# Altium project VCU.PrjPcb (part 2 of 4)

## Sheet 12V_Buck.SchDoc: Title
size A3; Project: Q24 VCU; ENG_APP_DATE: --/--/--; DSN_APP_DATE: --/--/--; CHK_APP_DATE: --/--/--; Date: *******; ApprovedBy: *******; CheckedBy: None; Author: *******; CompanyName: *******; DrawnBy: Jacob Chisholm; Engineer: *******; Organization: *******; Address1: *******; Address2: *******; Address3: *******; Address4: *******; DocumentNumber: 10; Revision: *******; SheetNumber: 10; SheetTotal: 14; Address_Website: https://jchisholm204.github.io; E-Mail: JacobChisholm1010@gmail.com; CurrentTime: *******; CurrentDate: *******; Time: *******; DocumentFullPathAndName: *******; DocumentName: *******; ModifiedDate: *******; ImagePath: *******; ProjectName: *******; Application_BuildNumber: *******
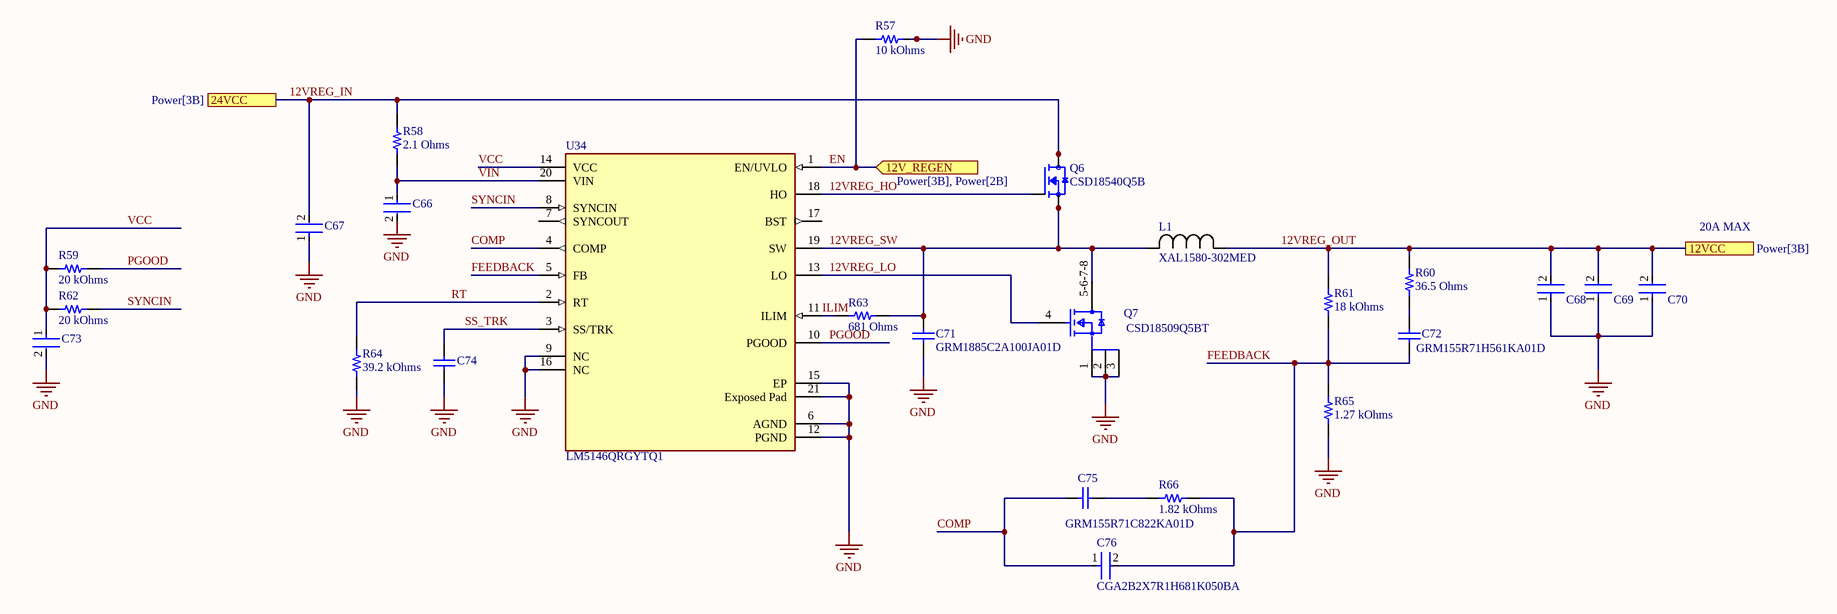
[diagram p5: 12V_Buck.SchDoc]

### Parts
C66  CGA3E2X7R1H104K080AA  [FP-CGA3E-0_3-0_1-IPC_A]  (value not drawn)
C67  GRM32ER71H475KA88L  [FP-GRM32-MFG]  (value not drawn)
C68  GRM32ER61E226KE15L  [FP-GRM32-MFG]  (value not drawn)
C69  GRM32ER61E226KE15L  [FP-GRM32-MFG]  (value not drawn)
C70  GRM32ER61E226KE15L  [FP-GRM32-MFG]  (value not drawn)
C71  GRM1885C2A100JA01D  [CAPC1608X90X35LL10T15]
C72  GRM155R71H561KA01D  [CAPC1005X55X25LL05T10]
C73  C1005X5R1V225K050BC  [FP-C1005-050-0_15-IPC_A]  (value not drawn)
C74  GRM155R71C563KA88D  [CAPC1005X55X25ML05T10]  (value not drawn)
C75  GRM155R71C822KA01D  [CAPC1005X55X25NL05T10]
C76  CGA2B2X7R1H681K050BA  [FP-CGA2B-IPC_C]
L1  XAL1580-302MED  [IND_XAL1580-302MED_COC]
Q6  CSD18540Q5B  [TRANS_CSD18540Q5B]
Q7  CSD18509Q5BT  [FP-DNK0008A-MFG]
R57  10 kOhms  [RES 0603_1608]
R58  2.1 Ohms  [RES 0603_1608]
R59  20 kOhms  [RES 0603_1608]
R60  36.5 Ohms  [RES 0603_1608]
R61  18 kOhms  [RES 0603_1608]
R62  20 kOhms  [RES 0603_1608]
R63  681 Ohms  [RES 0402_1005]
R64  39.2 kOhms  [RES 0603_1608]
R65  1.27 kOhms  [RES 0603_1608]
R66  1.82 kOhms  [RES 0603_1608]
U34  LM5146QRGYTQ1  [FP-RGY0020B-MFG]

### Ports
12V_REGEN (in, see Power[3B], Power[2B]), 12VCC (see Power[3B]), 24VCC (see Power[3B])

### Nets
GND: C66.2 C67.1 C68.1 C69.1 C70.1 C71.1 C73.2 C74.1 Q7.1(S) Q7.2(S) Q7.3(S) R57.2 R64.1 R65.1 U34.6(AGND) U34.9(NC) U34.12(PGND) U34.15(EP) U34.16(NC) U34.21(Exposed_Pad)
12VREG_HO: Q6.4(G) U34.18(HO)
12VREG_IN: C67.2 Q6.5(D) Q6.6(D) Q6.7(D) Q6.8(D) R58.2 ; port 24VCC
12VREG_LO: Q7.4(G) U34.13(LO)
12VREG_OUT: C68.2 C69.2 C70.2 L1.1 R60.2 R61.2 ; port 12VCC
12VREG_SW: C71.2 L1.2 Q6.1(S) Q6.2(S) Q6.3(S) Q7.5-6-7-8(D) R63.2 U34.19(SW)
COMP: C75.1 C76.1 U34.4(COMP)
EN: R57.1 U34.1(EN/UVLO) ; port 12V_REGEN  [project net 12V_REG_EN]
FEEDBACK: C72.1 C76.2 R61.1 R65.2 R66.2 U34.5(FB)
ILIM: R63.1 U34.11(ILIM)
PGOOD: R59.2 U34.10(PGOOD)
RT: R64.2 U34.2(RT)
SS_TRK: C74.2 U34.3(SS/TRK)
SYNCIN: R62.2 U34.8(SYNCIN)
VCC: C73.1 R59.1 R62.1 U34.14(VCC)
VIN: C66.1 R58.1 U34.20(VIN)
NetC72_2: C72.2 R60.1
NetC75_2: C75.2 R66.1

Not connected (* = marked no-connect by the designer): U34 7(SYNCOUT) 17(BST)

### Notes on the sheet
- 20A MAX
- Title:
- Drawn By:
- Page Contents:
- Checked By:
- Size:
- Date:
- File:
- License:
- Email:
- A3
- Number:
- Time:
- Revision:
- Sheet
- Website:
- of

### Library data of the parts
C66 = CMP-2000-07546-2: Cap Ceramic 100nF 50V X7R 10% Pad SMD 0603 +125°C Automotive T/R; Weight: 7.1E-05oz; Composition: Ceramic; Max Operating Temperature: 125°C; Termination: SMD/SMT; Dielectric: X7R; Length: 1.6mm; Package Quantity: 1; REACH SVHC: No SVHC; Lead Free: Lead Free; Case Code (Metric): 1608; Min Operating Temperature: -55°C; Packaging: Tape and Reel; Tolerance: 10%; Voltage Rating: 50V; Case Code (Imperial): 0603; Capacitance: 100nF; Case/Package: 0603; Voltage Rating (DC): 50V; Depth: 0.8mm; Radiation Hardening: No; Ratings: AEC-Q200; Mount: Surface Mount; Voltage: 50V; Thickness: 0.035inch; Width: 0.8mm; Height: 0.8mm
C67 = CMP-1038-02162-3: CAP CER 4.7UF 50V X7R 1210; Manufacturer: Murata; Tolerance: 10%; Temperature Coefficient: 15%; Material: Ceramic; Lead Free: Yes; Value: 4.7uF; ComponentLink2Description: Datasheet; Capacitance: 4.7uF; Digikey Description: CAP CER 4.7UF 50V X7R 1210; Category: Cap; Automotive: No; ComponentLink2URL: https://search.murata.co.jp/Ceramy/image/img/A01X/G101/ENG/GRM32ER71H475KA88-01A.pdf; Package: GRM32; Device Class L2: Capacitors; Voltage Rating: 50V; Device Class L1: Passive Components; Mouser Description: Capacitor Capacitance tolerance: ±10% Ceramic type: X7R Construction form: 1210 Capacitance: 4.7 µF Rated voltage: 50...; Octopart: https://octopart.com/grm32er71h475ka88l-murata-196576; Temperature: -55°C to +125°C; Temperature Range Low: -55°C; Height: 2.7mm; Manufacturer Part Number: GRM32ER71H475KA88L; Temperature Characteristic: X7R; Temperature Range High: +125°C; RoHS: TRUE; Device Class L3: Ceramic Capacitors
C68-C70 = CMP-2000-05458-2: CAP CER 22UF 25V X5R 1210; Manufacturer: Murata Electronics North America; Possible Substitute: GRM32ER61E226KE15K; Other Names: 490-3889-2; Material: Ceramic; Tolerance: 10%; Digikey Description: CAP CER 22UF 25V X5R 1210; Mouser Description: Multilayer Ceramic Capacitors MLCC - SMD/SMT 1210 22uF 25volts X5R 10%; Device Class L2: Capacitors; Height: 2.7mm; Temperature Characteristic: X5R; Category: Cap; RoHS: TRUE; Operating Temperature: -55°C ~ 85°C; Temperature: -55°C to +85°C; Lead Free: Yes; Package: GRM32; Temperature Range High: +85°C; Package / Case: 1210 (3225 Metric); Standard Package: 1,000; Packaging: Cut Tape (CT); Capacitance: 22uF; Thickness (Max): 0.106" (2.70mm); Value: 22uF; Automotive: No; Device Class L1: Passive Components; Voltage - Rated: 25V; Temperature Range Low: -55°C; Size / Dimension: 0.126" L x 0.098" W (3.20mm x 2.50mm); ComponentLink2Description: Datasheet; Device Class L3: Ceramic Capacitors; Temperature Coefficient: X5R; ComponentLink2URL: https://search.murata.co.jp/Ceramy/image/img/A01X/G101/ENG/GRM32ER61E226KE15-01A.pdf; Voltage Rating: 25V; Manufacturer Part Number: GRM32ER61E226KE15L; Octopart: https://octopart.com/grm32er61e226ke15l-murata-197441; Applications: General Purpose; Mounting Type: Surface Mount, MLCC
C71 = CMP-1035-00565-2: Manufacturer: Murata; Part Number: GRM1885C2A100JA01D
C72 = CMP-2008-04664-1: Manufacturer: Murata; Part Number: GRM155R71H561KA01D
C73 = CMP-08246-007153-1: CAP CER 2.2UF 35V X5R 0402; Dielectric Material: Ceramic; Tolerance: 10%; Package Quantity: 1; Voltage Rating: 35V; Case Code (Metric): 1005; Width: 0.5mm; RoHS Compliant: Yes; Capacitance: 2.2uF; Min Operating Temperature: -55°C; Packaging: Tape and Reel; Voltage Rating (DC): 35V; Thickness: 0.022inch; REACH SVHC: No SVHC; Max Operating Temperature: 85°C; Length: 1mm; Case Code (Imperial): 0402; Resistor Type: Ceramic; Lead Free: Lead Free; Series: C; Termination: SMD/SMT; Height: 0.5mm; Mount: Surface Mount; Case/Package: 0402; Weight: 2.3E-05oz; Dielectric: X5R; Depth: 0.5mm
C74 = CMP-2008-04611-1: Manufacturer: Murata; Part Number: GRM155R71C563KA88D
C75 = CMP-2008-03950-1: Manufacturer: Murata; Part Number: GRM155R71C822KA01D
C76 = CMP-08246-001669-1: Cap Ceramic 680pF 50V X7R 10% Pad SMD 0402 +125°C Automotive T/R; Thickness: 0.022inch; Case Code (Metric): 1005; Voltage Rating: 50V; REACH SVHC: No SVHC; Packaging: Tape and Reel; Min Operating Temperature: -55°C; Case/Package: 0402; Weight: 2.3E-05oz; Tolerance: 10%; Dielectric: X7R; Width: 0.02inch; Case Code (Imperial): 0402; Depth: 0.5mm; Mount: Surface Mount; Length: 1mm; Max Operating Temperature: 125°C; Composition: Ceramic; Termination: SMD/SMT; Voltage Rating (DC): 50V; Height: 0.5mm; Capacitance: 680pF; Ratings: AEC-Q200; Package Quantity: 1
L1 = XAL1580-302MED: No Description Available; Mfr_Name: Coilcraft; Type: DEV; Copyright: Copyright (C) 2024 Ultra Librarian. All rights reserved.; Manufacturer_Part_Number: XAL1580-302MED; RefDes: RefDes
Q6 = CSD18540Q5B: 60-V, N channel NexFETâ„¢ power MOSFET, single SON 5 mm x 6 mm, 2.2 mOhm; MF: Texas Instruments; SnapEDA_Link: https://www.snapeda.com/parts/CSD18540Q5B/Texas+Instruments/view-part/?ref=snap; Purchase-URL: https://pricing.snapeda.com/search/part/CSD18540Q5B/?ref=eda; Package: VSON-CLIP-8 Texas Instruments; MP: CSD18540Q5B; Price: None; Availability: In Stock; Check_prices: https://www.snapeda.com/parts/CSD18540Q5B/Texas+Instruments/view-part/?ref=eda; Value: *
Q7 = CMP-04962-000031-1: MOSFET N-CH 40V 100A 8VSON; Max Power Dissipation: 195W; Drain to Source Resistance: 1.3mR; Gate to Source Voltage (Vgs): 20V; Threshold Voltage: 1.8V; Number of Channels: 1; Rise Time: 19ns; Turn-Off Delay Time: 57ns; Element Configuration: Single; Power Dissipation: 3.1W; Rds On Max: 1.2mR; Fall Time: 11ns; Turn-On Delay Time: 9ns; Input Capacitance: 13.9nF; Packaging: Tape and Reel; Weight: 0.000847oz; Lead Free: Contains Lead; Contact Plating: Gold; Drain to Source Breakdown Voltage: 40V; Max Operating Temperature: 150°C; Number of Elements: 1; Package Quantity: 250; Mount: Surface Mount; Drain to Source Voltage (Vdss): 40V; Number of Pins: 8; Min Operating Temperature: -55°C; REACH SVHC: No SVHC; RoHS Compliant: Yes; Continuous Drain Current (ID): 100A
R57 = AA0603FR-0710KL: RES SMD 10K OHM 1% 1/10W 0603; Manufacturer: Yageo; Power (Watts): 0.1W, 1/10W; Temperature Coefficient: ±150ppm/°C; Part Number: AA0603FR-0710KL; Value: 10 kOhms; ComponentLink1Description: Datasheet; ComponentLink1URL: https://www.yageo.com/upload/media/product/productsearch/datasheet/rchip/PYu-AA_51_RoHS_L_3.pdf; ComponentLink2Description: DigiKey Link; ComponentLink2URL: https://www.digikey.com/en/products/detail/yageo/AA0603FR-0710KL/5888698; Composition: Thick Film; Device Package: 0603 (1608 Metric); Features: Anti-Sulfur, Automotive AEC-Q200, Moisture Resistant; Height - Seated (Max): 0.022" (0.55mm); LastUpdated: 1/24/2024 8:37:51 PM; Lifecycle Status: Active; Minimum Order: 1; Number of Terminations: 2; Operating Temperature: -55°C ~ 155°C; Package / Case: 0603 (1608 Metric); Packaging: TapeAndReel; PartId: 64302; Part Status: Active; Price: 0.01; Ratings: AEC-Q200; Resistance: 10 kOhms; Series: AA; Size / Dimension: 0.063" L x 0.031" W (1.60mm x 0.80mm); Supplier 1: DigiKey; Supplier Part Number 1: 13-AA0603FR-0710KLCT-ND; Supplier Device Package: 0603; Tolerance: ±1%
R58 = CRCW06032R10FKEA: RES SMD 2.1 OHM 1% 1/10W 0603; Manufacturer: Vishay Dale; Power (Watts): 0.1W, 1/10W; Temperature Coefficient: ±100ppm/°C; Part Number: CRCW06032R10FKEA; Value: 2.1 Ohms; ComponentLink1Description: Datasheet; ComponentLink1URL: http://www.vishay.com/docs/20035/dcrcwe3.pdf; ComponentLink2Description: DigiKey Link; ComponentLink2URL: https://www.digikey.com/en/products/detail/vishay-dale/CRCW06032R10FKEA/1961571; Composition: Thick Film; Device Package: 0603 (1608 Metric); Features: Automotive AEC-Q200; Height - Seated (Max): 0.020" (0.50mm); LastUpdated: 1/16/2024 8:42:05 PM; Lifecycle Status: Active; Minimum Order: 1; Number of Terminations: 2; Operating Temperature: -55°C ~ 155°C; Package / Case: 0603 (1608 Metric); Packaging: TapeAndReel; PartId: 12898; Part Status: Active; Price: 0.01; Ratings: AEC-Q200; Resistance: 2.1 Ohms; Series: CRCW; Size / Dimension: 0.061" L x 0.033" W (1.55mm x 0.85mm); Supplier 1: DigiKey; Supplier Part Number 1: 541-2.10HHCT-ND; Supplier Device Package: 0603; Tolerance: ±1%
R59 R62 = AC0603FR-0720KL: RES SMD 20K OHM 1% 1/10W 0603; Manufacturer: Yageo; Power (Watts): 0.1W, 1/10W; Temperature Coefficient: ±100ppm/°C; Part Number: AC0603FR-0720KL; Value: 20 kOhms; ComponentLink1Description: Datasheet; ComponentLink1URL: https://www.yageo.com/upload/media/product/productsearch/datasheet/rchip/PYu-AC_51_RoHS_L_7.pdf; ComponentLink2Description: DigiKey Link; ComponentLink2URL: https://www.digikey.com/en/products/detail/yageo/AC0603FR-0720KL/5895907; Composition: Thick Film; Device Package: 0603 (1608 Metric); Features: Automotive AEC-Q200, Moisture Resistant; Height - Seated (Max): 0.022" (0.55mm); LastUpdated: 1/16/2024 8:41:47 PM; Lifecycle Status: Active; Minimum Order: 1; Number of Terminations: 2; Operating Temperature: -55°C ~ 155°C; Package / Case: 0603 (1608 Metric); Packaging: CutTape; PartId: 17364; Part Status: Active; Price: 0.01; Ratings: AEC-Q200; Resistance: 20 kOhms; Series: AC; Size / Dimension: 0.063" L x 0.031" W (1.60mm x 0.80mm); Supplier 1: DigiKey; Supplier Part Number 1: YAG3577CT-ND; Supplier Device Package: 0603; Tolerance: ±1%
R60 = CRCW060336R5FKEA: RES SMD 36.5 OHM 1% 1/10W 0603; Manufacturer: Vishay Dale; Power (Watts): 0.1W, 1/10W; Temperature Coefficient: ±100ppm/°C; Part Number: CRCW060336R5FKEA; Value: 36.5 Ohms; ComponentLink1Description: Datasheet; ComponentLink1URL: http://www.vishay.com/docs/20035/dcrcwe3.pdf; ComponentLink2Description: DigiKey Link; ComponentLink2URL: https://www.digikey.com/en/products/detail/vishay-dale/CRCW060336R5FKEA/1174503; Composition: Thick Film; Device Package: 0603 (1608 Metric); Features: Automotive AEC-Q200; Height - Seated (Max): 0.020" (0.50mm); LastUpdated: 1/24/2024 8:39:33 PM; Lifecycle Status: Active; Minimum Order: 1; Number of Terminations: 2; Operating Temperature: -55°C ~ 155°C; Package / Case: 0603 (1608 Metric); Packaging: TapeAndReel; PartId: 7915; Part Status: Active; Price: 0.01; Ratings: AEC-Q200; Resistance: 36.5 Ohms; Series: CRCW; Size / Dimension: 0.061" L x 0.033" W (1.55mm x 0.85mm); Supplier 1: DigiKey; Supplier Part Number 1: 541-36.5HCT-ND; Supplier Device Package: 0603; Tolerance: ±1%
R61 = AC0603FR-0718KL: RES SMD 18K OHM 1% 1/10W 0603; Manufacturer: Yageo; Power (Watts): 0.1W, 1/10W; Temperature Coefficient: ±100ppm/°C; Part Number: AC0603FR-0718KL; Value: 18 kOhms; ComponentLink1Description: Datasheet; ComponentLink1URL: https://www.yageo.com/upload/media/product/productsearch/datasheet/rchip/PYu-AC_51_RoHS_L_7.pdf; ComponentLink2Description: DigiKey Link; ComponentLink2URL: https://www.digikey.com/en/products/detail/yageo/AC0603FR-0718KL/5895836; Composition: Thick Film; Device Package: 0603 (1608 Metric); Features: Automotive AEC-Q200, Moisture Resistant; Height - Seated (Max): 0.022" (0.55mm); LastUpdated: 1/24/2024 8:38:56 PM; Lifecycle Status: Active; Minimum Order: 1; Number of Terminations: 2; Operating Temperature: -55°C ~ 155°C; Package / Case: 0603 (1608 Metric); Packaging: CutTape; PartId: 17436; Part Status: Active; Price: 0.01; Ratings: AEC-Q200; Resistance: 18 kOhms; Series: AC; Size / Dimension: 0.063" L x 0.031" W (1.60mm x 0.80mm); Supplier 1: DigiKey; Supplier Part Number 1: YAG3570CT-ND; Supplier Device Package: 0603; Tolerance: ±1%
R63 = ERJ-2RKF6810X: RES SMD 681 OHM 1% 1/10W 0402; Manufacturer: Panasonic Electronic Components; Power (Watts): 0.1W, 1/10W; Temperature Coefficient: ±100ppm/°C; Part Number: ERJ-2RKF6810X; Value: 681 Ohms; ComponentLink1Description: Datasheet; ComponentLink1URL: https://industrial.panasonic.com/cdbs/www-data/pdf/RDA0000/AOA0000C304.pdf; ComponentLink2Description: DigiKey Link; ComponentLink2URL: https://www.digikey.com/en/products/detail/panasonic-electronic-components/ERJ-2RKF6810X/192449; Composition: Thick Film; Device Package: 0402 (1005 Metric); Features: Automotive AEC-Q200; Height - Seated (Max): 0.016" (0.40mm); LastUpdated: 1/24/2024 8:27:52 PM; Lifecycle Status: Active; Minimum Order: 1; Number of Terminations: 2; Operating Temperature: -55°C ~ 155°C; Package / Case: 0402 (1005 Metric); Packaging: CutTape; PartId: 3811; Part Status: Active; Price: 0.01; Ratings: AEC-Q200; Resistance: 681 Ohms; Series: ERJ-2RK; Size / Dimension: 0.039" L x 0.020" W (1.00mm x 0.50mm); Supplier 1: DigiKey; Supplier Part Number 1: P681LCT-ND; Supplier Device Package: 0402; Tolerance: ±1%
R64 = 5-2176089-3: RES SMD 39.2K OHM 0.1% 1/6W 0603; Manufacturer: TE Connectivity Passive Product; Power (Watts): 0.167W, 1/6W; Temperature Coefficient: ±25ppm/°C; Part Number: 5-2176089-3; Value: 39.2 kOhms; ComponentLink1Description: Datasheet; ComponentLink1URL: https://www.te.com/commerce/DocumentDelivery/DDEController?Action=srchrtrv&DocNm=1773272&DocType=DS&DocLang=English; ComponentLink2Description: DigiKey Link; ComponentLink2URL: https://www.digikey.com/en/products/detail/te-connectivity-passive-product/5-2176089-3/4033729; Composition: Thin Film; Device Package: 0603 (1608 Metric); Height - Seated (Max): 0.022" (0.55mm); LastUpdated: 1/16/2024 8:41:51 PM; Lifecycle Status: Active; Minimum Order: 1; Number of Terminations: 2; Operating Temperature: -55°C ~ 155°C; Package / Case: 0603 (1608 Metric); Packaging: TapeAndReel; PartId: 16250; Part Status: Active; Price: 0.14; Resistance: 39.2 kOhms; Series: RP73P, Holsworthy; Size / Dimension: 0.061" L x 0.031" W (1.55mm x 0.80mm); Supplier 1: DigiKey; Supplier Part Number 1: A110261CT-ND; Supplier Device Package: 0603; Tolerance: ±0.1%
R65 = 2-2176088-2: RES SMD 1.27K OHM 0.1% 1/6W 0603; Manufacturer: TE Connectivity Passive Product; Power (Watts): 0.167W, 1/6W; Temperature Coefficient: ±25ppm/°C; Part Number: 2-2176088-2; Value: 1.27 kOhms; ComponentLink1Description: Datasheet; ComponentLink1URL: https://www.te.com/commerce/DocumentDelivery/DDEController?Action=srchrtrv&DocNm=1773272&DocType=DS&DocLang=English; ComponentLink2Description: DigiKey Link; ComponentLink2URL: https://www.digikey.com/en/products/detail/te-connectivity-passive-product/2-2176088-2/4033586; Composition: Thin Film; Device Package: 0603 (1608 Metric); Height - Seated (Max): 0.022" (0.55mm); LastUpdated: 1/24/2024 8:38:18 PM; Lifecycle Status: Active; Minimum Order: 1; Number of Terminations: 2; Operating Temperature: -55°C ~ 155°C; Package / Case: 0603 (1608 Metric); Packaging: TapeAndReel; PartId: 24589; Part Status: Active; Price: 0.14; Resistance: 1.27 kOhms; Series: RP73P, Holsworthy; Size / Dimension: 0.061" L x 0.031" W (1.55mm x 0.80mm); Supplier 1: DigiKey; Supplier Part Number 1: A110118CT-ND; Supplier Device Package: 0603; Tolerance: ±0.1%
R66 = AC0603FR-071K82L: RES SMD 1.82K OHM 1% 1/10W 0603; Manufacturer: Yageo; Power (Watts): 0.1W, 1/10W; Temperature Coefficient: ±100ppm/°C; Part Number: AC0603FR-071K82L; Value: 1.82 kOhms; ComponentLink1Description: Datasheet; ComponentLink1URL: https://www.yageo.com/upload/media/product/productsearch/datasheet/rchip/PYu-AC_51_RoHS_L_9.pdf; ComponentLink2Description: DigiKey Link; ComponentLink2URL: https://www.digikey.com/en/products/detail/yageo/AC0603FR-071K82L/5895873; Composition: Thick Film; Device Package: 0603 (1608 Metric); Features: Automotive AEC-Q200, Moisture Resistant; Height - Seated (Max): 0.022" (0.55mm); LastUpdated: 1/24/2024 8:37:18 PM; Lifecycle Status: Active; Minimum Order: 1; Number of Terminations: 2; Operating Temperature: -55°C ~ 155°C; Package / Case: 0603 (1608 Metric); Packaging: CutTape; PartId: 72129; Part Status: Active; Price: 0.01; Ratings: AEC-Q200; Resistance: 1.82 kOhms; Series: AC; Size / Dimension: 0.063" L x 0.031" W (1.60mm x 0.80mm); Supplier 1: DigiKey; Supplier Part Number 1: 13-AC0603FR-071K82LCT-ND; Supplier Device Package: 0603; Tolerance: ±1%
U34 = CMP-04918-000302-1: IC REG BUCK ADJ 3.5A 20VQFN; RoHS Compliant: Yes

## Sheet 5V_Buck.SchDoc: Title
size A3; Project: Q24 VCU; ENG_APP_DATE: --/--/--; DSN_APP_DATE: --/--/--; CHK_APP_DATE: --/--/--; Date: *******; ApprovedBy: *******; CheckedBy: None; Author: *******; CompanyName: *******; DrawnBy: Jacob Chisholm; Engineer: *******; Organization: *******; Address1: *******; Address2: *******; Address3: *******; Address4: *******; DocumentNumber: 11; Revision: *******; SheetNumber: 11; SheetTotal: 14; Address_Website: https://jchisholm204.github.io; E-Mail: JacobChisholm1010@gmail.com; CurrentTime: *******; CurrentDate: *******; Time: *******; DocumentFullPathAndName: *******; DocumentName: *******; ModifiedDate: *******; ImagePath: *******; ProjectName: *******; Application_BuildNumber: *******
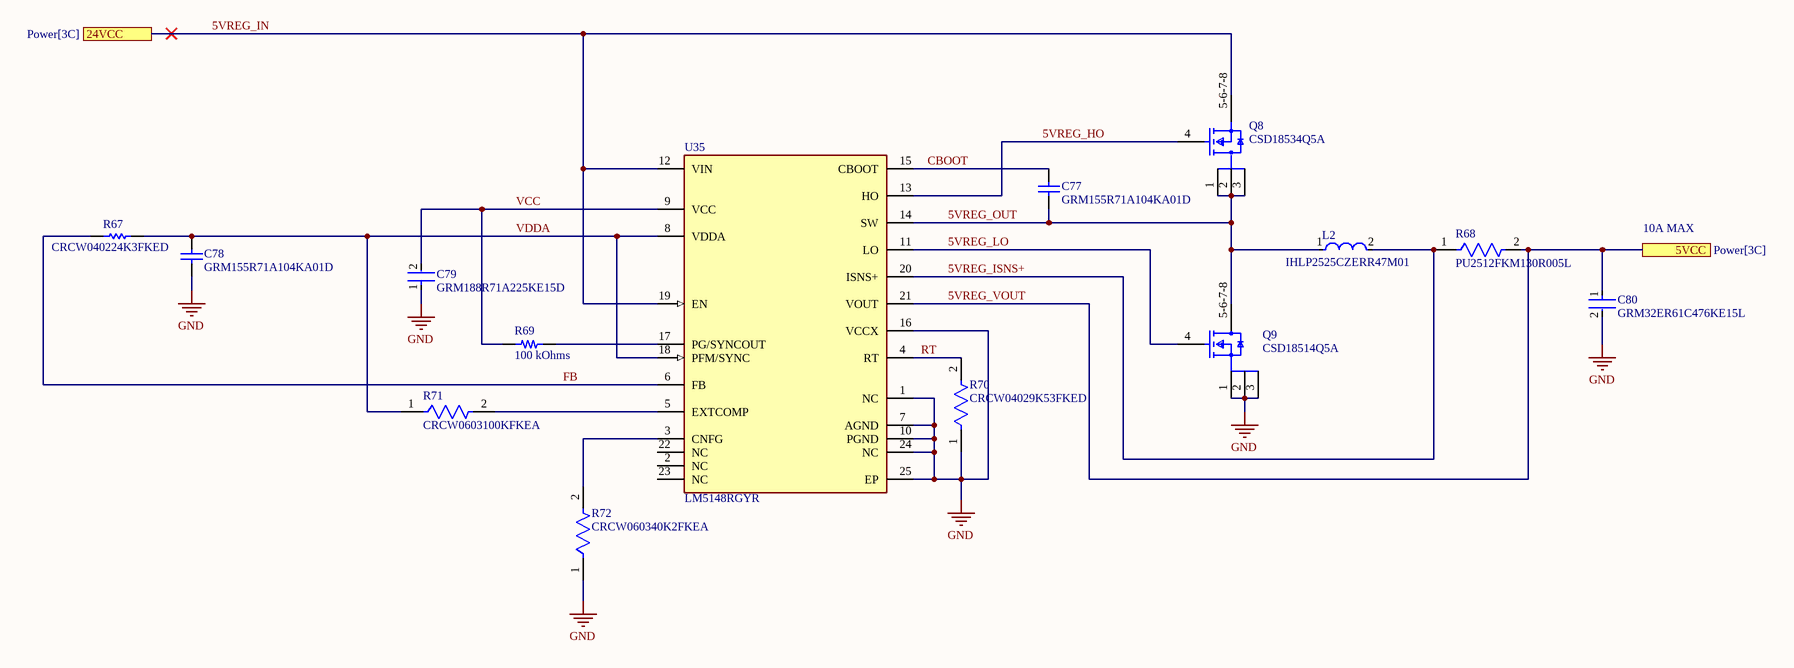
[diagram p6: 5V_Buck.SchDoc]

### Parts
C77  GRM155R71A104KA01D  [CAPC1005X55X25LL05T10]
C78  GRM155R71A104KA01D  [CAPC1005X55X25LL05T10]
C79  GRM188R71A225KE15D  [FP-GRM188-0_1-e0_2_0_5-MFG]
C80  GRM32ER61C476KE15L  [FP-GRM32E-0_3-0_2-IPC_C]
L2  IHLP2525CZERR47M01  [FP-IHLP-2525CZ-FP_2_413x3-MFG]
Q8  CSD18534Q5A  [FP-DQJ0008A-MFG]
Q9  CSD18514Q5A  [FP-DQJ0008A-MFG]
R67  CRCW040224K3FKED  [RESC1005X40X25LL05T05]
R68  PU2512FKM130R005L  [FP-PU2512-0R005-MFG]
R69  100 kOhms  [RES 0603_1608]
R70  CRCW04029K53FKED  [FP-CRCW0402-e3-MFG]
R71  CRCW0603100KFKEA  [FP-CRCW0603-e3-IPC_C]
R72  CRCW060340K2FKEA  [FP-CRCW0603-e3-IPC_B]
U35  LM5148RGYR  [FP-RGY0024F-MFG]

### Ports
5VCC (see Power[3C]), 24VCC (see Power[3C])

### Nets
GND: C78.1 C79.1 C80.2 Q9.1(S) Q9.2(S) Q9.3(S) R70.1 R72.1 U35.1(NC) U35.7(AGND) U35.10(PGND) U35.16(VCCX) U35.24(NC) U35.25(EP)
5VREG_HO: Q8.4(G) U35.13(HO)
5VREG_IN: Q8.5-6-7-8(D) U35.12(VIN) U35.19(EN) ; port 24VCC
5VREG_ISNS+: L2.2 R68.1 U35.20(ISNS+)
5VREG_LO: Q9.4(G) U35.11(LO)
5VREG_OUT: C77.1 L2.1 Q8.1(S) Q8.2(S) Q8.3(S) Q9.5-6-7-8(D) U35.14(SW)
5VREG_VOUT: C80.1 R68.2 U35.21(VOUT) ; port 5VCC
CBOOT: C77.2 U35.15(CBOOT)
FB: R67.1 U35.6(FB)
RT: R70.2 U35.4(RT)
VCC: C79.2 R69.1 U35.9(VCC)
VDDA: C78.2 R67.2 R71.1 U35.8(VDDA) U35.18(PFM/SYNC)
NetR69_2: R69.2 U35.17(PG/SYNCOUT)
NetR71_2: R71.2 U35.5(EXTCOMP)
NetR72_2: R72.2 U35.3(CNFG)

Not connected (* = marked no-connect by the designer): U35 2(NC) 22(NC) 23(NC)

### Notes on the sheet
- 10A MAX
- Title:
- Drawn By:
- Page Contents:
- Checked By:
- Size:
- Date:
- File:
- License:
- Email:
- A3
- Number:
- Time:
- Revision:
- Sheet
- Website:
- of

### Library data of the parts
C77 C78 = CMP-2000-06331-1: Chip Capacitor, 0.1 uF, +/- 10%, 10 V, -55 to 125 degC, 0402 (1005 Metric), RoHS, Tape and Reel; Manufacturer: Murata; Rated Voltage: 10V; Capacitance: 100000pF; Dielectric: X7R; Manufacturer URL: http://www.murata.com/; Datasheet Version: 02/2016; Datasheet URL: http://search.murata.co.jp/Ceramy/image/img/A01X/G101/ENG/GRM155R71A104KA01-01.pdf; Package Reference: 0402; Tolerance (%): ±10%; Package Description: 2-Pin Surface Mount Device, Body 1 x 0.5 mm; Mounting Technology: SurfaceMount; Case Size/Dimension: 0402
C79 = CMP-2006-02836-2: Chip Multilayer Ceramic Capacitors for General Purpose, 0603, 2.2uF, X7R, 15%, 10%, 10V; Case Code (Metric): 1608; Height: 0.8mm; Packaging: Cut Tape; Voltage: 10V; Lead Free: Lead Free; Min Operating Temperature: -55°C; Voltage Rating (DC): 10V; Max Operating Temperature: 125°C; Voltage Rating: 10V; Dielectric: X7R; Depth: 0.8mm; Case Code (Imperial): 0603; Termination: SMD/SMT; Case/Package: 0603; Number of Pins: 2; REACH SVHC: No SVHC; Mount: Surface Mount; Width: 0.031inch; Material: Ceramic; Capacitance: 2.2uF; Package Quantity: 1; Weight: 7.1E-05oz; Length: 1.6mm; Thickness: 0.035inch; Tolerance: 10%
C80 = CMP-2000-06362-2: CAP CER 47UF 16V X5R 1210; Tolerance: 10%; Material: Ceramic; Case Code (Metric): 3225; RoHS Compliant: Yes; Min Operating Temperature: -55°C; Radiation Hardening: No; Voltage: 16V; Package Quantity: 1; Case Code (Imperial): 1210; REACH SVHC: No SVHC; Capacitance: 47uF; Voltage Rating (DC): 16V; Dielectric: X5R; Case/Package: 1210; Length: 3.2mm; Voltage Rating: 16V; Packaging: Cut Tape; Width: 0.098inch; Number of Pins: 2; Lead Free: Lead Free; Height: 2.5mm; Mount: Surface Mount; Termination: SMD/SMT; Max Operating Temperature: 85°C; Thickness: 0.106inch; Depth: 2.5mm
L2 = CMP-2000-06445-2: Commercial Inductors, High Saturation Series 0.47uH 17.5A 4.2mΩ 20%; Saturation Current: 26A; Shielding: Shielded; Test Frequency: 100kHz; DC Resistance (DCR): 4.2mR; Self Resonant Frequency: 5MHz; Core Material: Metal; Inductance: 470nH; Case Code (Imperial): 2525; Packaging: Tape and Reel; Length: 7.24mm; Mount: Surface Mount; Contact Plating: Tin; Inductance Tolerance: 20%; Width: 6.47mm; Tolerance: 20%; Current Rating: 17.5A; Max Operating Temperature: 125°C; Min Operating Temperature: -55°C; Height - Seated (Max): 0.118inch; Case/Package: 2525; Number of Pins: 2; Depth: 6.72mm; Radiation Hardening: No; Max DC Current: 26A; Termination: SMD/SMT; Package Quantity: 2000; Lead Free: Lead Free; RMS Current (Irms): 17.5A; Height: 3mm; Military Standard: Not
Q8 = CMP-04962-000014-1: MOSFET N-CH 60V 8SON; Manufacturer: Texas Instruments; Reverse Recovery Time: 40ns; Input Capacitace At Vds: 1360pF @ 30V; Transconductance: 72S; Gate Charge At Vgs: 17nC @ 10V; Threshold Vgs Max: 2.3V; Threshold Vgs Min: 1.5V; Number Of Channels: 1; Rthja Max: 50°C/W; Continuous Drain Current: 13A; Typ Forward Diode Voltage: 0.8V; Max Forward Diode Voltage: 1V; Gate To Source Voltage: 20V; Depletion Mode: False; Turn Off Delay Time: 15ns; Drain To Source Resistance: 7.8mΩ; Max Junction Temp: +150°C; Pulse Drain Current: 229A; Power Dissipation: 3.1W; Turn On Delay Time: 5.2ns; Reverse Recovery Charge: 54nC; Digikey Description: MOSFET N-CH 60V 8SON; ComponentLink2URL: http://www.ti.com/lit/ds/symlink/csd18534q5a.pdf; Temperature Range High: +150°C; Drain To Source Voltage: 60V; Automotive: No; RoHS: TRUE; Mouser Description: MOSFET 60V N-Ch NexFET Pwr MOSFET; Temperature Range Low: -55°C; Manufacturer Part Number: CSD18534Q5A; Octopart: https://octopart.com/csd18534q5a-texas+instruments-22791040; Device Class L1: Discrete Semiconductors; Device Class L2: Transistors; ComponentLink2Description: Datasheet; Number Of N Channels: 1; Height: 1.1mm; Device Class L3: MOSFETs; Temperature: -55°C to +150°C; Lead Free: Yes; Drain To Source Breakdown Voltage: 60V; Package: DQJ0008A; Category: Trans
Q9 = CMP-04962-000077-1: MOSFET N-CH 40V 89A 8VSON; Max Power Dissipation: 74W; Rds On Max: 7.9mR; Element Configuration: Single; Number of Pins: 8; Min Operating Temperature: -55°C; Mount: Surface Mount; Packaging: Cut Tape; Drain to Source Voltage (Vdss): 40V; Max Operating Temperature: 150°C; Continuous Drain Current (ID): 89A; RoHS Compliant: Yes
R67 = CMP-2002-08406-1: Manufacturer: Vishay Dale; Part Number: CRCW040224K3FKED
R68 = CMP-03412-006804-1: METAL SHUNT RESISTOR 2512 1% 75P; Manufacturer: Yageo; Temperature Coefficient: 75ppm/°C; Resistance: 5mΩ; Automotive Grade: Grade 0; Power Rating: 4W; Value: 5mΩ; Temperature Range High: +170°C; Octopart: https://octopart.com/pu2512fkm130r005l-yageo-96774569; Series: PU; Device Class L2: Resistors; RoHS: TRUE; Device Class L1: Passive Components; Temperature Range Low: -65°C; Digikey Description: METAL SHUNT RESISTOR 2512 1% 75P; Composition: Metal Element; Automotive: Yes; Manufacturer Part Number: PU2512FKM130R005L; Lead Free: Yes; Package: PU2512-0R005; ComponentLink2URL: http://www.yageo.com/documents/recent/PYu-PU_51_RoHS_L_6.pdf; Device Class L3: Chip SMD Resistors; Height: 0.94mm; Category: Res; Temperature: -65°C to +170°C; Ipc Land Pattern Name: RESC635318X66; Tolerance: 1%; ComponentLink2Description: Datasheet
R69 = AA0603FR-07100KL: RES SMD 100K OHM 1% 1/10W 0603; Manufacturer: Yageo; Power (Watts): 0.1W, 1/10W; Temperature Coefficient: ±150ppm/°C; Part Number: AA0603FR-07100KL; Value: 100 kOhms; ComponentLink1Description: Datasheet; ComponentLink1URL: https://www.yageo.com/upload/media/product/productsearch/datasheet/rchip/PYu-AA_51_RoHS_L_3.pdf; ComponentLink2Description: DigiKey Link; ComponentLink2URL: https://www.digikey.com/en/products/detail/yageo/AA0603FR-07100KL/5888687; Composition: Thick Film; Device Package: 0603 (1608 Metric); Features: Anti-Sulfur, Automotive AEC-Q200, Moisture Resistant; Height - Seated (Max): 0.022" (0.55mm); LastUpdated: 1/24/2024 8:36:54 PM; Lifecycle Status: Active; Minimum Order: 1; Number of Terminations: 2; Operating Temperature: -55°C ~ 155°C; Package / Case: 0603 (1608 Metric); Packaging: TapeAndReel; PartId: 78895; Price: 0.01; Ratings: AEC-Q200; Resistance: 100 kOhms; Series: AA; Size / Dimension: 0.063" L x 0.031" W (1.60mm x 0.80mm); Supplier 1: DigiKey; Supplier Part Number 1: 13-AA0603FR-07100KLCT-ND; Supplier Device Package: 0603; Tolerance: ±1%
R70 = CMP-2002-00289-2: RES Thick Film, 9.53kΩ, 1%, 0.063W, 100ppm/°C, 0402; Max Power Dissipation: 63mW; Voltage Rating: 50V; Resistance: 9.53kR; Length: 1mm; Radiation Hardening: No; Width: 0.02inch; Package Quantity: 10; Temperature Coefficient: 100ppm/°C; Tolerance: 1%; Packaging: Tape and Reel; Termination: SMD/SMT; Weight: 2.3E-05oz; Number of Terminations: 2; Power Rating: 63mW; Case/Package: 0402; Case Code (Metric): 1005; Case Code (Imperial): 0402; Mount: Surface Mount; Contact Plating: Tin; Height: 0.35mm; Number of Pins: 2; Composition: Thick Film; Min Operating Temperature: -55°C; Military Standard: Not; Features: Automotive AEC-Q200; Depth: 0.5mm; Max Operating Temperature: 155°C
R71 = CMP-2000-03820-2: RES Thick Film, 100kΩ, 1%, 0.1W, 100ppm/°C, 0603; Power Rating: 100mW; Voltage Rating (DC): 75V; Resistance: 100kR; Width: 0.033inch; Temperature Coefficient: 100ppm/°C; Case/Package: 0603; Max Operating Temperature: 155°C; Packaging: Tape and Reel; Number of Pins: 2; Termination: SMD/SMT; Case Code (Metric): 1608; Composition: Thick Film; Radiation Hardening: No; Min Operating Temperature: -55°C; Voltage Rating: 75V; Lead Free: Lead Free; Number of Terminations: 2; Height: 0.45mm; Case Code (Imperial): 0603; Features: Automotive AEC-Q200; Length: 1.55mm; Max Power Dissipation: 100mW; Package Quantity: 10; Military Standard: Not; Tolerance: 1%; Depth: 0.85mm; Contact Plating: Tin; Weight: 7.1E-05oz
R72 = CMP-2000-03336-2: RES Thick Film, 40.2kΩ, 1%, 0.1W, 100ppm/°C, 0603; Voltage Rating (DC): 75V; Power Rating: 100mW; Resistance: 40.2kR; Packaging: Tape and Reel; Radiation Hardening: No; Lead Free: Lead Free; Contact Plating: Tin; Weight: 7.1E-05oz; Voltage Rating: 75V; Temperature Coefficient: 100ppm/°C; Case Code (Imperial): 0603; Max Operating Temperature: 155°C; Width: 0.85mm; Package Quantity: 5000; Termination: SMD/SMT; Case/Package: 0603; Case Code (Metric): 1608; Depth: 0.85mm; Tolerance: 1%; Composition: Thick Film; Length: 1.55mm; Military Standard: Not; Height: 0.45mm; Min Operating Temperature: -55°C
U35 = CMP-00370-134678441-1: LM5148RGYR 3.5-V to 80-V, current mode synchronous buck controller 24-VQFN -40 to 125; Manufacturer Lifecycle Status: ACTIVE; Case/Package: VQFN; Lifecycle Status: Production; Width: 3.5mm; Length: 5.5mm; NexarPartId: 134678441; Height: 1mm; Number of Pins: 24; Thickness: 900µm

## Sheet 24V_Load_Switches.SchDoc: Title
size A3; Project: Q24 VCU; ENG_APP_DATE: --/--/--; DSN_APP_DATE: --/--/--; CHK_APP_DATE: --/--/--; Date: *******; ApprovedBy: *******; CheckedBy: None; Author: *******; CompanyName: *******; DrawnBy: Jacob Chisholm; Engineer: *******; Organization: *******; Address1: *******; Address2: *******; Address3: *******; Address4: *******; DocumentNumber: 5; Revision: *******; SheetNumber: 5; SheetTotal: 14; Address_Website: https://jchisholm204.github.io; E-Mail: JacobChisholm1010@gmail.com; CurrentTime: *******; CurrentDate: *******; Time: *******; DocumentFullPathAndName: *******; DocumentName: *******; ModifiedDate: *******; ImagePath: *******; ProjectName: *******; Application_BuildNumber: *******
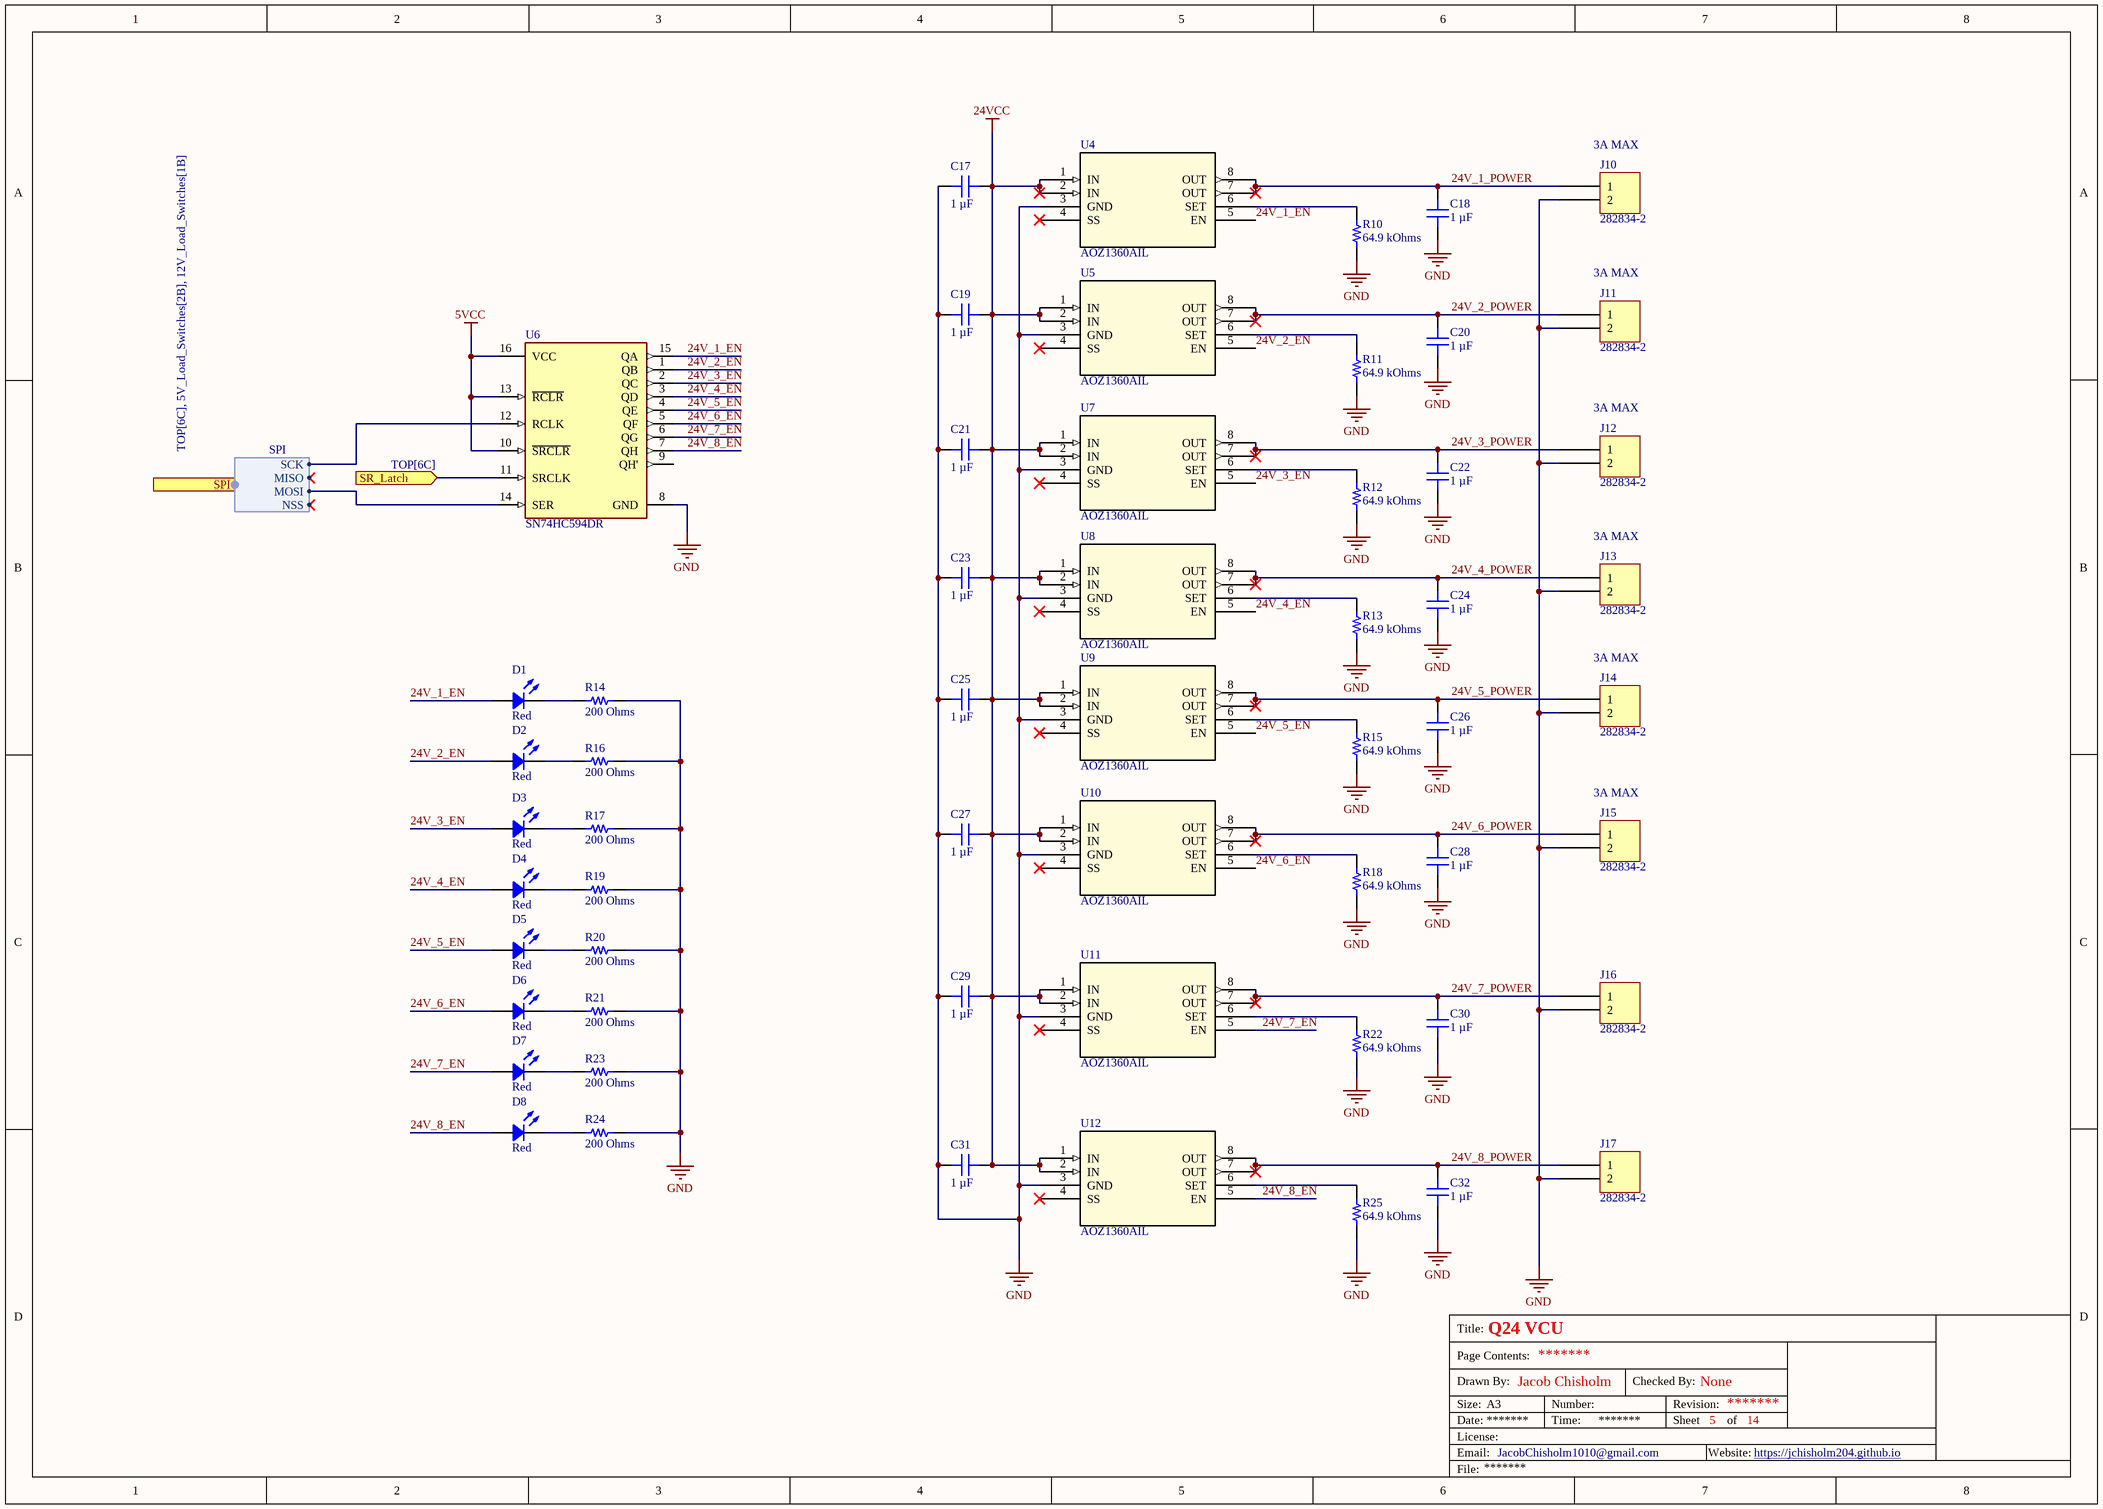
[diagram p7: 24V_Load_Switches.SchDoc]

### Parts
C17  1 µF  [CAP 0805_2012]
C18  1 µF  [CAP 0805_2012]
C19  1 µF  [CAP 0805_2012]
C20  1 µF  [CAP 0805_2012]
C21  1 µF  [CAP 0805_2012]
C22  1 µF  [CAP 0805_2012]
C23  1 µF  [CAP 0805_2012]
C24  1 µF  [CAP 0805_2012]
C25  1 µF  [CAP 0805_2012]
C26  1 µF  [CAP 0805_2012]
C27  1 µF  [CAP 0805_2012]
C28  1 µF  [CAP 0805_2012]
C29  1 µF  [CAP 0805_2012]
C30  1 µF  [CAP 0805_2012]
C31  1 µF  [CAP 0805_2012]
C32  1 µF  [CAP 0805_2012]
D1  Red  [LED 0603_1608 RED]
D2  Red  [LED 0603_1608 RED]
D3  Red  [LED 0603_1608 RED]
D4  Red  [LED 0603_1608 RED]
D5  Red  [LED 0603_1608 RED]
D6  Red  [LED 0603_1608 RED]
D7  Red  [LED 0603_1608 RED]
D8  Red  [LED 0603_1608 RED]
J10  282834-2  [TE 282834-2]
J11  282834-2  [TE 282834-2]
J12  282834-2  [TE 282834-2]
J13  282834-2  [TE 282834-2]
J14  282834-2  [TE 282834-2]
J15  282834-2  [TE 282834-2]
J16  282834-2  [TE 282834-2]
J17  282834-2  [TE 282834-2]
R10  64.9 kOhms  [RES 0603_1608]
R11  64.9 kOhms  [RES 0603_1608]
R12  64.9 kOhms  [RES 0603_1608]
R13  64.9 kOhms  [RES 0603_1608]
R14  200 Ohms  [RES 0603_1608]
R15  64.9 kOhms  [RES 0603_1608]
R16  200 Ohms  [RES 0603_1608]
R17  200 Ohms  [RES 0603_1608]
R18  64.9 kOhms  [RES 0603_1608]
R19  200 Ohms  [RES 0603_1608]
R20  200 Ohms  [RES 0603_1608]
R21  200 Ohms  [RES 0603_1608]
R22  64.9 kOhms  [RES 0603_1608]
R23  200 Ohms  [RES 0603_1608]
R24  200 Ohms  [RES 0603_1608]
R25  64.9 kOhms  [RES 0603_1608]
U4  AOZ1360AIL  [AOZ1360AIL_AOS]
U5  AOZ1360AIL  [AOZ1360AIL_AOS]
U6  SN74HC594DR  [FP-D0016A-IPC_A]
U7  AOZ1360AIL  [AOZ1360AIL_AOS]
U8  AOZ1360AIL  [AOZ1360AIL_AOS]
U9  AOZ1360AIL  [AOZ1360AIL_AOS]
U10  AOZ1360AIL  [AOZ1360AIL_AOS]
U11  AOZ1360AIL  [AOZ1360AIL_AOS]
U12  AOZ1360AIL  [AOZ1360AIL_AOS]

### Ports
SPI (harness SPI, see TOP[6C], 5V_Load_Switches[2B], 12V_Load_Switches[1B]), SR_Latch (in, see TOP[6C])

### Harnesses
SPI: NSS, SCK, MISO, MOSI

### Nets
5VCC: U6.10(~{SRCLR}) U6.13(~{RCLR}) U6.16(VCC)
24VCC: C17.1 C19.1 C21.1 C23.1 C25.1 C27.1 C29.2 C31.2 U4.1(IN) U4.2(IN) U5.1(IN) U5.2(IN) U7.1(IN) U7.2(IN) U8.1(IN) U8.2(IN) U9.1(IN) U9.2(IN) U10.1(IN) U10.2(IN) U11.1(IN) U11.2(IN) U12.1(IN) U12.2(IN)
GND: C17.2 C18.1 C19.2 C20.1 C21.2 C22.1 C23.2 C24.1 C25.2 C26.1 C27.2 C28.1 C29.1 C30.1 C31.1 C32.1 J10.2 J11.2 J12.2 J13.2 J14.2 J15.2 J16.2 J17.2 R10.1 R11.1 R12.1 R13.1 R14.2 R15.1 R16.2 R17.2 R18.1 R19.2 R20.2 R21.2 R22.1 R23.2 R24.2 R25.1 U4.3(GND) U5.3(GND) U6.8(GND) U7.3(GND) U8.3(GND) U9.3(GND) U10.3(GND) U11.3(GND) U12.3(GND)
24V_1_EN: D1.1 U4.5(EN) U6.15(QA)
24V_1_POWER: C18.2 J10.1 U4.7(OUT) U4.8(OUT)
24V_2_EN: D2.1 U5.5(EN) U6.1(QB)
24V_2_POWER: C20.2 J11.1 U5.7(OUT) U5.8(OUT)
24V_3_EN: D3.1 U6.2(QC) U7.5(EN)
24V_3_POWER: C22.2 J12.1 U7.7(OUT) U7.8(OUT)
24V_4_EN: D4.1 U6.3(QD) U8.5(EN)
24V_4_POWER: C24.2 J13.1 U8.7(OUT) U8.8(OUT)
24V_5_EN: D5.1 U6.4(QE) U9.5(EN)
24V_5_POWER: C26.2 J14.1 U9.7(OUT) U9.8(OUT)
24V_6_EN: D6.1 U6.5(QF) U10.5(EN)
24V_6_POWER: C28.2 J15.1 U10.7(OUT) U10.8(OUT)
24V_7_EN: D7.1 U6.6(QG) U11.5(EN)
24V_7_POWER: C30.2 J16.1 U11.7(OUT) U11.8(OUT)
24V_8_EN: D8.1 U6.7(QH) U12.5(EN)
24V_8_POWER: C32.2 J17.1 U12.7(OUT) U12.8(OUT)
SPI2_MOSI: U6.14(SER) ; port SPI.MOSI
SPI2_SCK: U6.12(RCLK) ; port SPI.SCK
SR_Latch_24V_LS: U6.11(SRCLK) ; port SR_Latch
NetD1_2: D1.2 R14.1
NetD2_2: D2.2 R16.1
NetD3_2: D3.2 R17.1
NetD4_2: D4.2 R19.1
NetD5_2: D5.2 R20.1
NetD6_2: D6.2 R21.1
NetD7_2: D7.2 R23.1
NetD8_2: D8.2 R24.1
NetR10_2: R10.2 U4.6(SET)
NetR11_2: R11.2 U5.6(SET)
NetR12_2: R12.2 U7.6(SET)
NetR13_2: R13.2 U8.6(SET)
NetR15_2: R15.2 U9.6(SET)
NetR18_2: R18.2 U10.6(SET)
NetR22_2: R22.2 U11.6(SET)
NetR25_2: R25.2 U12.6(SET)

Not connected (* = marked no-connect by the designer): U4 4(SS)*; U5 4(SS)*; U6 9(QH'); U7 4(SS)*; U8 4(SS)*; U9 4(SS)*; U10 4(SS)*; U11 4(SS)*; U12 4(SS)*

### Notes on the sheet
- (near J10) 3A MAX
- (near J11) 3A MAX
- (near J12) 3A MAX
- (near J13) 3A MAX
- (near J14) 3A MAX
- (near J15) 3A MAX
- Title:
- Drawn By:
- Page Contents:
- Checked By:
- Size:
- Date:
- File:
- License:
- Email:
- A3
- Number:
- Time:
- Revision:
- Sheet
- Website:
- of

### Library data of the parts
C17-C28 = GCJ21BR71H105KA01L: CAP CER 1UF 50V X7R 0805; manufacturer: Murata Electronics; Tolerance: ±10%; Part Number: GCJ21BR71H105KA01L; Value: 1 µF; Applications: Automotive, Boardflex Sensitive; Capacitance: 1 µF; componentlink1description: Datasheet; componentlink1url: https://www.murata.com/~/media/webrenewal/support/library/catalog/products/capacitor/mlcc/c03e.ashx?la=en-us; componentlink2description: DigiKey Link; componentlink2url: https://www.digikey.com/en/products/detail/murata-electronics/GCJ21BR71H105KA01L/4903512; Device Package: 0805 (2012 Metric); Features: Soft Termination; lastupdated: 12/20/2023 8:14:07 PM; Lifecycle Status: Active; Minimum Order: 1; Mounting Type: Surface Mount, MLCC; Operating Temperature: -55°C ~ 125°C; Package / Case: 0805 (2012 Metric); packaging: TapeAndReel; partid: 2709; Part Status: Active; price: 0.05; Ratings: AEC-Q200; series: GCJ; Size / Dimension: 0.079" L x 0.049" W (2.00mm x 1.25mm); Supplier 1: DigiKey; Supplier Part Number 1: 490-10667-1-ND; Temperature Coefficient: X7R; Thickness (Max): 0.057" (1.45mm); Voltage - Rated: 50V
C29-C32 = 08051Z105KAT2A: 0805 X7S 1UF10% 100V; manufacturer: KYOCERA AVX; Tolerance: ±10%; Part Number: 08051Z105KAT2A; Value: 1 µF; Applications: General Purpose; Capacitance: 1 µF; componentlink1description: Datasheet; componentlink1url: https://datasheets.kyocera-avx.com/X7S.pdf; componentlink2description: DigiKey Link; componentlink2url: https://www.digikey.com/en/products/detail/kyocera-avx/08051Z105KAT2A/17866368; Device Package: 0805 (2012 Metric); lastupdated: 2/1/2024 8:13:20 PM; Lifecycle Status: Active; Minimum Order: 1; Mounting Type: Surface Mount, MLCC; Operating Temperature: -55°C ~ 125°C; Package / Case: 0805 (2012 Metric); packaging: TapeAndReel; partid: 54857; Part Status: Active; price: 0.08; series: -; Size / Dimension: 0.079" L x 0.049" W (2.01mm x 1.25mm); Supplier 1: DigiKey; Supplier Part Number 1: 478-08051Z105KAT2ACT-ND; Temperature Coefficient: X7S; Voltage - Rated: 100V
D1-D8 = 19-213SDRC/S259/TR8: LED RED CLEAR 2SMD; Manufacturer: Everlight Electronics Co Ltd; Configuration: Standard; Current - Test: 10mA; Lens Color: Colorless; Lens Size: 1.20mm x 0.80mm; Lens Style: Rectangle with Flat Top; Viewing Angle: 120°; Voltage - Forward (Vf) (Typ): 2V; Wavelength - Peak: 650nm; Part Number: 19-213SDRC/S259/TR8; Color: Red; ComponentLink1Description: Datasheet; ComponentLink1URL: //media.digikey.com/pdf/Data%20Sheets/Everlight%20PDFs/19-213SDRC-S259-TR8.pdf; ComponentLink2Description: DigiKey Link; ComponentLink2URL: http://digikey.com/product-detail/en/everlight-electronics-co-ltd/19-213SDRC-S259-TR8/1080-1580-1-ND/8535303; Device Package: 0603 (1608 Metric); Height (Max): 0.70mm; LastUpdated: 2/2/2024 9:29:56 PM; Lens Transparency: Clear; Lifecycle Status: Active; Minimum Order: 1; Mounting Type: Surface Mount; Package / Case: 0603 (1608 Metric); Packaging: TapeAndReel; PartId: 372; Part Status: Active; Price: 0.06; Series: -; Size / Dimension: 1.60mm L x 0.80mm W; Supplier 1: DigiKey; Supplier Part Number 1: 1080-1580-1-ND; Supplier Device Package: 2-SMD; Value: Red
J10-J17 = 282834-2: TERM BLK 2P SIDE ENT 2.54MM PCB; Manufacturer: TE Connectivity AMP Connectors; Current: 10A; Mating Orientation: Horizontal with Board; Number of Levels: 1; Pitch: 0.100" (2.54mm); Positions Per Level: 2; Voltage: 150V; Wire Gauge: 16-30 AWG; Wire Termination: Screw - Rising Cage Clamp; Part Number: 282834-2; Color: Green; ComponentLink1Description: Datasheet; ComponentLink1URL: https://www.te.com/commerce/DocumentDelivery/DDEController?Action=srchrtrv&DocNm=282834&DocType=Customer+Drawing&DocLang=English; ComponentLink2Description: DigiKey Link; ComponentLink2URL: http://digikey.com/product-detail/en/te-connectivity-amp-connectors/282834-2/A98333-ND/1150135; LastUpdated: 1/15/2020 4:15:38 AM; Lifecycle Status: Active; Minimum Order: 1; Mounting Type: Through Hole; Packaging: Bulk; Part Status: Active; Price: 0.88; Series: Buchanan; Supplier 1: DigiKey; Supplier Part Number 1: A98333-ND
R10-R13 R15 R18 = 7-2176089-3: RES SMD 64.9K OHM 0.1% 1/6W 0603; Manufacturer: TE Connectivity Passive Product; Power (Watts): 0.167W, 1/6W; Temperature Coefficient: ±25ppm/°C; Part Number: 7-2176089-3; Value: 64.9 kOhms; ComponentLink1Description: Datasheet; ComponentLink1URL: https://www.te.com/commerce/DocumentDelivery/DDEController?Action=srchrtrv&DocNm=1773272&DocType=DS&DocLang=English; ComponentLink2Description: DigiKey Link; ComponentLink2URL: https://www.digikey.com/en/products/detail/te-connectivity-passive-product/7-2176089-3/4033750; Composition: Thin Film; Device Package: 0603 (1608 Metric); Height - Seated (Max): 0.022" (0.55mm); LastUpdated: 12/19/2023 8:39:23 PM; Lifecycle Status: Active; Minimum Order: 1; Number of Terminations: 2; Operating Temperature: -55°C ~ 155°C; Package / Case: 0603 (1608 Metric); Packaging: TapeAndReel; PartId: 23912; Part Status: Active; Price: 0.14; Resistance: 64.9 kOhms; Series: RP73P, Holsworthy; Size / Dimension: 0.061" L x 0.031" W (1.55mm x 0.80mm); Supplier 1: DigiKey; Supplier Part Number 1: A110282CT-ND; Supplier Device Package: 0603; Tolerance: ±0.1%
R14 R16 R17 R19-R21 R23 R24 = RS73F1JTTD2000B: RES 200 OHM 0.1% 1/5W 0603; Manufacturer: KOA Speer Electronics, Inc.; Power (Watts): 0.2W, 1/5W; Temperature Coefficient: ±25ppm/°C; Part Number: RS73F1JTTD2000B; Value: 200 Ohms; ComponentLink1Description: Datasheet; ComponentLink1URL: http://www.koaspeer.com/pdfs/RS73.pdf; ComponentLink2Description: DigiKey Link; ComponentLink2URL: https://www.digikey.com/en/products/detail/koa-speer-electronics-inc/RS73F1JTTD2000B/11594419; Composition: Thick Film; Device Package: 0603 (1608 Metric); Features: Automotive AEC-Q200, Moisture Resistant; Height - Seated (Max): 0.022" (0.55mm); LastUpdated: 2/2/2024 8:38:37 PM; Lifecycle Status: Active; Minimum Order: 1; Number of Terminations: 2; Operating Temperature: -55°C ~ 155°C; Package / Case: 0603 (1608 Metric); Packaging: TapeAndReel; PartId: 56369; Part Status: Active; Price: 0.07; Ratings: AEC-Q200; Resistance: 200 Ohms; Series: RS73; Size / Dimension: 0.063" L x 0.031" W (1.60mm x 0.80mm); Supplier 1: DigiKey; Supplier Part Number 1: 2019-RS73F1JTTD2000BCT-ND; Supplier Device Package: 0603; Tolerance: ±0.1%
R22 R25 = PTN0603E6492BST1: RES 64.9K OHM 0.1% 0.15W 0603; Manufacturer: Vishay Thin Film; Temperature Coefficient: ±25ppm/°C; Part Number: PTN0603E6492BST1; Value: 64.9 kOhms; ComponentLink1Description: Datasheet; ComponentLink1URL: http://www.vishay.com/docs/60026/ptn.pdf; ComponentLink2Description: DigiKey Link; ComponentLink2URL: http://digikey.com/product-detail/en/vishay-thin-film/PTN0603E6492BST1/764-1449-1-ND/7103233; Composition: Thin Film; Device Package: 0603 (1608 Metric); Features: Anti-Sulfur, Moisture Resistant, Non-Inductive; Height - Seated (Max): 0.020" (0.51mm); LastUpdated: 2/1/2024 8:39:11 PM; Lifecycle Status: Active; Minimum Order: 1; Number of Terminations: 2; Operating Temperature: -55°C ~ 155°C; Package / Case: 0603 (1608 Metric); Packaging: TapeAndReel; PartId: 22193; Part Status: Active; Power (Watts): 0.15W; Price: 0.21; Resistance: 64.9 kOhms; Series: PTN; Size / Dimension: 0.064" L x 0.032" W (1.63mm x 0.81mm); Supplier 1: DigiKey; Supplier Part Number 1: 764-1449-1-ND; Supplier Device Package: 0603; Tolerance: ±0.1%
U4 U5 U7-U12 = AOZ1360AIL: No Description Available; Mfr_Name: Alpha and Omega Semiconductor; Manufacturer_Part_Number: AOZ1360AIL; RefDes: RefDes; Type: DEV
  U4 U5 U7-U10: Copyright: Copyright (C) 2023 Ultra Librarian. All rights reserved.
  U11 U12: Copyright: Copyright (C) 2024 Ultra Librarian. All rights reserved.
U6 = CMP-0780-00061-4: IC SHIFT REGISTER 8BIT 16-SOIC; Number of Bits per Element: 8; Min Supply Voltage: 2V; Frequency: 40MHz; Max Supply Voltage: 6V; Operating Supply Voltage: 5V; Number of Output Lines: 10; Propagation Delay: 25ns; Number of Elements: 1; Number of Circuits: 4; Direction: Unidirectional; Turn-On Delay Time: 185ns; RoHS Compliant: Yes; Width: 3.91mm; Length: 9.9mm; Min Operating Temperature: -40°C; Max Operating Temperature: 125°C; Package Quantity: 2500; Series: 74HC; Height: 1.58mm; Number of Bits: 8; Mount: Surface Mount; Logic Function: Shift Register; Radiation Hardening: No; Number of Pins: 16; Technology: CMOS; Packaging: Tape and Reel; Lead Free: Lead Free; Weight: 0.004998oz; REACH SVHC: No SVHC; Case/Package: SOIC